# Altium schematic sheet Power.SchDoc
size 279 x 215 mm
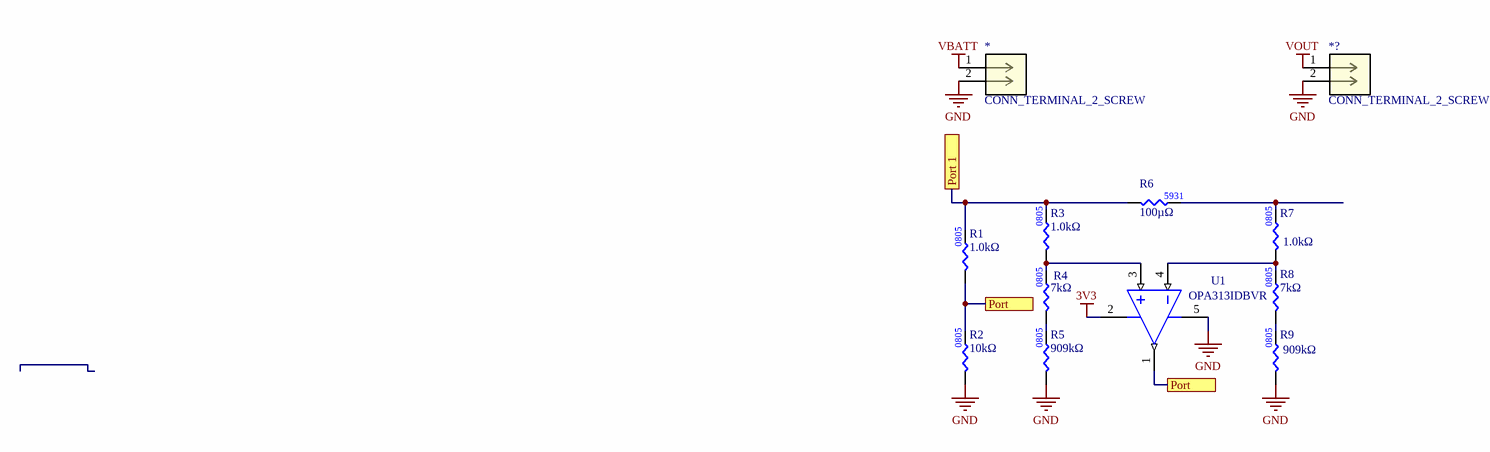
[diagram p0: Power.SchDoc]

## Parts
*  CONN_TERMINAL_2_SCREW  [Model Name]
*?  CONN_TERMINAL_2_SCREW  [Model Name]
R1  value 1.0kΩ  [RES0805]  (hidden comment: RES_1kΩ_0805_1%)
R2  value 10kΩ  [RES0805]  (hidden comment: RES_10kΩ_0805_5%)
R3  value 1.0kΩ  [RES0805]  (hidden comment: RES_1kΩ_0805_1%)
R4  value 7kΩ  [RES0805]  (hidden comment: RES_7kΩ_0805_0.1%)
R5  value 909kΩ  [RES0805]  (hidden comment: RES_909kΩ_0805_0.1%)
R6  value 100µΩ  [RES-5931]  (hidden comment: RES_100µΩ_5931_1%)
R7  value 1.0kΩ  [RES0805]  (hidden comment: RES_1kΩ_0805_1%)
R8  value 7kΩ  [RES0805]  (hidden comment: RES_7kΩ_0805_0.1%)
R9  value 909kΩ  [RES0805]  (hidden comment: RES_909kΩ_0805_0.1%)
U1  Manufacturer Part Number 1: OPA313IDBVR  [DBV0005A_M]  (hidden comment: OPAMP_OPA313IDBVR)

## Ports
Port, Port 1

## Nets
3V3: U1.2(V-)
GND: *.2 *?.2 R2.1 R5.1 R9.1 U1.5(V+)
VBATT: *.1
VOUT: *?.1
Port: R1.1 R2.2 U1.1(OUT) ; port Port
Port 1: R1.2 R3.2 R6.1 ; port Port 1
NetR3_1: R3.1 R4.2 U1.3(IN+)
NetR4_1: R4.1 R5.2
NetR6_2: R6.2 R7.2
NetR7_1: R7.1 R8.2 U1.4(IN-)
NetR8_1: R8.1 R9.2

## Notes on the sheet
- University of Waterloo Robotics Team
- 200 University Ave W
- REV
- PROJECT
- Waterloo, Ontario, Canada
- N2L 3G1
- DOCUMENT
- ENGINEER
- REVIEWER
- MODIFIED
- SHEET
- OF
- (in symbol RES_100µΩ_5931_1%) 5931

## Library data of the parts
R1 R3 R7 = RES_1kΩ_0805_1%: RES 1K OHM 1% 1/8W 0805; Manufacturer 1: Yageo; Manufacturer Part Number 1: RC0805FR-071K07L; Supplier 1: Digi-Key; Mounting Type: SMD; Supplier Part Number 1: 311-1.07KCRCT-ND; Package: 0805
R2 = RES_10kΩ_0805_5%: RES 10K OHM 5% 1/8W 0805; Manufacturer 1: Panasonic Electronic Components; Manufacturer Part Number 1: ERJ-6GEYJ103V; Package/Footprint: 0805; Supplier 1: Digi-Key; Supplier Part Number 1: P10KACT-ND; LCSC Part #: C17414; Mounting Type: SMD
R4 R8 = RES_7kΩ_0805_0.1%: RES 7K OHM 0.1% 1/5W 0805; Manufacturer 1: Panasonic Electronic Components; Manufacturer Part Number 1: ERJ-6GEYJ103V; Package/Footprint: 0805; Supplier 1: Digi-Key; Supplier Part Number 1: P10KACT-ND; LCSC Part #: C17414; Mounting Type: SMD
R5 R9 = RES_909kΩ_0805_0.1%: RES 909K OHM 0.1% 5/8W 0805; Manufacturer 1: Panasonic Electronic Components; Manufacturer Part Number 1: ERJ-6GEYJ103V; Package/Footprint: 0805; Supplier 1: Digi-Key; Supplier Part Number 1: P10KACT-ND; LCSC Part #: C17414; Mounting Type: SMD
R6 = RES_100µΩ_5931_1%: RES 100µ OHM 1% 15W 5931; Manufacturer 1: Panasonic Electronic Components; Manufacturer Part Number 1: ERJ-6GEYJ103V; Part Number: 13-PU5931FKIPB0U1LTR-ND; Package/Footprint: 0805; LCSC Part #: C17414; Mounting Type: SMD; Power: 15W; Supplier 1: DigiKey; Supplier Part Number 1: P10KACT-ND; Supplier 2: Digikey; Supplier Part Number 2: 13-PU5931FKIPB0U1LCT-ND
U1 = OPAMP_OPA313IDBVR: IC OPAMP GP 1 CIRCUIT SOT23-5; Manufacturer 1: Texas Instruments; Package: SOT-23-5; Mounting Type: SMD; Supplier Part Number 1: 296-35607-1-ND; Supplier 1: Digi-Key; Verified: No
* *? = CONN_TERMINAL_2_SCREW: ComponentLink1Description: New link; ComponentLink1URL: https://www.digikey.ca/en/products/detail/phoenix-contact/1935161/568614